# EAGLE design main (EAGLE 9.3.0)
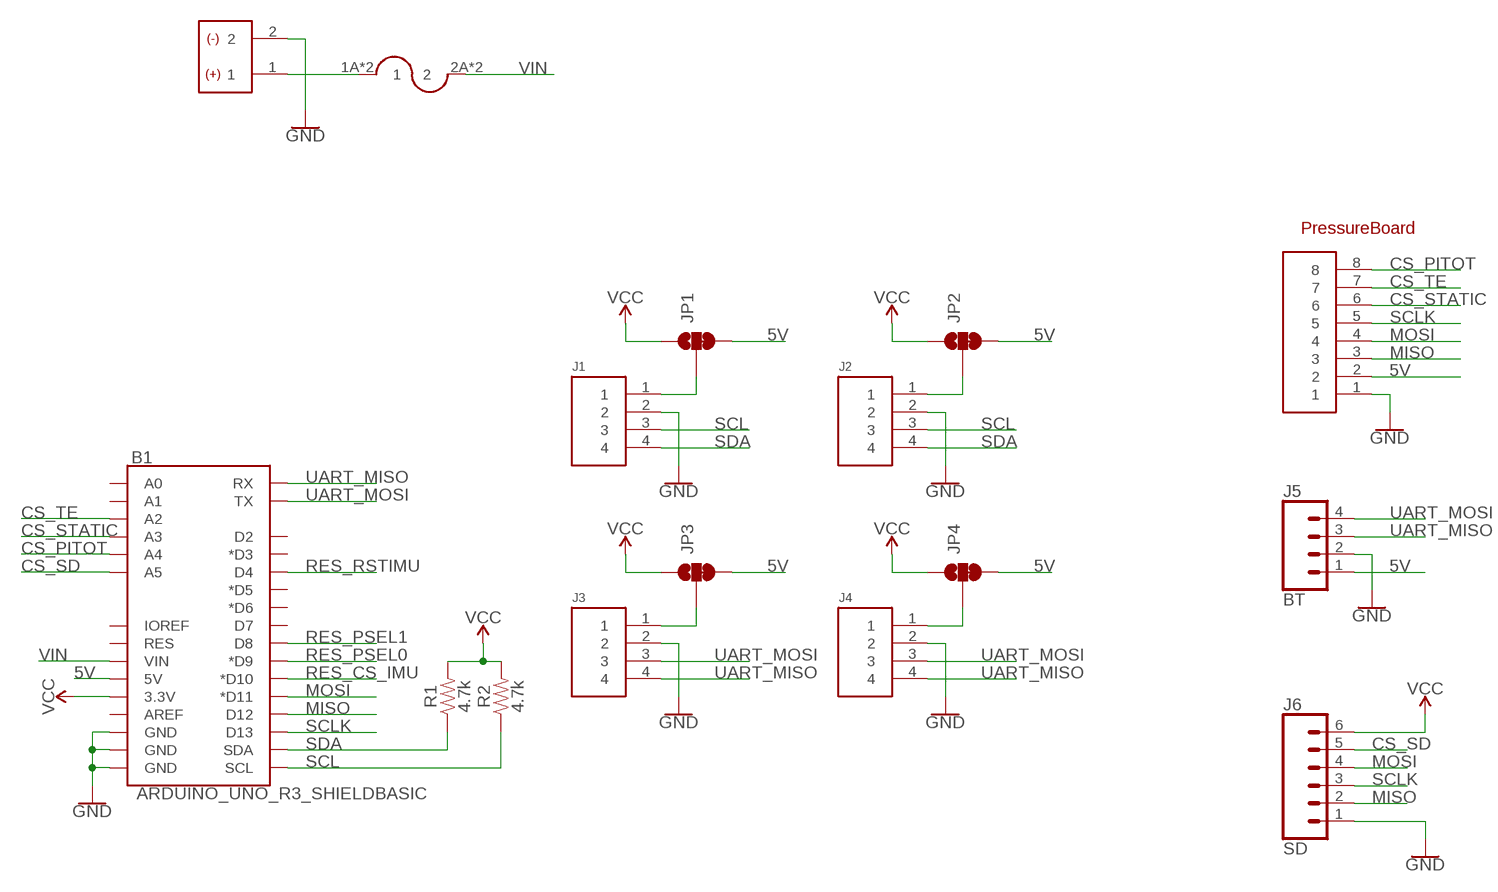
[diagram p0: schematic, sheet 1]

## Parts
B1  ARDUINO_UNO_R3_SHIELDBASIC  [UNO_R3_SHIELD]
J1  HEADER4VALULOK  [4PINVALULOK]
J2  HEADER4VALULOK  [4PINVALULOK]
J3  HEADER4VALULOK  [4PINVALULOK]
J4  HEADER4VALULOK  [4PINVALULOK]
J5  BT  CONN_041X04_NO_SILK  [1X04_NO_SILK]
J6  SD  CONN_06NO_SILK_NO_POP  [1X06_NO_SILK]
JP1  JUMPER-SMT_3_1-NC_TRACE_SILK  [SMT-JUMPER_3_1-NC_TRACE_SILK]
JP2  JUMPER-SMT_3_1-NC_TRACE_SILK  [SMT-JUMPER_3_1-NC_TRACE_SILK]
JP3  JUMPER-SMT_3_1-NC_TRACE_SILK  [SMT-JUMPER_3_1-NC_TRACE_SILK]
JP4  JUMPER-SMT_3_1-NC_TRACE_SILK  [SMT-JUMPER_3_1-NC_TRACE_SILK]
R1  4.7k  4.7KOHM-0603-1/10W-1%  [0603]
R2  4.7k  4.7KOHM-0603-1/10W-1%  [0603]
U$1  PB  HEADER8  [8PINVALULOK]
U$2  FUSE  [AUTO_FUSE]
U$3  HEADER2  [2PINVALULOK]

## Nets
5V: B1.5V J5.1 JP1.3 JP2.3 JP3.3 JP4.3 U$1.2
CS_PITOT: B1.A4 U$1.8
CS_SD: B1.A5 J6.5
CS_STATIC: B1.A3 U$1.6
CS_TE: B1.A2 U$1.7
GND: B1.GND@0(GND) B1.GND@1(GND) B1.GND@2(GND) J1.2 J2.2 J3.2 J4.2 J5.2 J6.1 U$1.1 U$3.2
MISO: B1.D12 J6.2 U$1.3
MOSI: B1.D11(*D11) J6.4 U$1.4
N$1: J2.1 JP2.2
N$2: J1.1 JP1.2
N$3: J3.1 JP3.2
N$4: J4.1 JP4.2
N$5: U$2.1A U$2.1B U$3.1
RES_CS_IMU: B1.D10(*D10)
RES_PSEL0: B1.D9(*D9)
RES_PSEL1: B1.D8
RES_RSTIMU: B1.D4
SCL: B1.SCL J1.3 J2.3 R2.1
SCLK: B1.D13 J6.3 U$1.5
SDA: B1.SDA J1.4 J2.4 R1.1
UART_MISO: B1.RX J3.4 J4.4 J5.3
UART_MOSI: B1.TX J3.3 J4.3 J5.4
VCC: B1.3.3V J6.6 JP1.1 JP2.1 JP3.1 JP4.1 R1.2 R2.2
VIN: B1.VIN U$2.2A U$2.2B
Unconnected: B1.A0 B1.A1 B1.AREF B1.D2 B1.D3(*D3) B1.D5(*D5) B1.D6(*D6) B1.D7 B1.IOREF B1.RES

## Notes on the sheet
- PressureBoard

## Library data of the parts
B1 = SparkFun-Boards:ARDUINO_UNO_R3_SHIELD: Arduino R3 Shield Footprint Shield form compatible with the Arduino Uno R3. SparkFun Products: MG2639 Cellular Shield <https://www.sparkfun.com/products/13120> MIDI Shield <https://www.sparkfun.com/products/12898> R3 Stackable Headers Kit <https://www.sparkfun.com/products/11417>
J1-J4 = Custom_old:HEADER4
J5 = SparkFun-Connectors:CONN_04: Multi connection point. Often used as Generic Header-pin footprint for 0.1 inch spaced/style header connections On any of the 0.1 inch spaced packages, you can populate with these: Break Away Headers - Straight <https://www.sparkfun.com/products/116> (PRT-00116) Break Away Male Headers - Right Angle <https://www.sparkfun.com/products/553> (PRT-00553) Female Headers <https://www.sparkfun.com/products/115> (PRT-00115) Break Away Headers - Machine Pin <https://www.sparkfun.com/products/117> (PRT-00117) Break Away Female Headers - Swiss Machine Pin <https://www.sparkfun.com/products/743> (PRT-00743) For SCREWTERMINALS and SPRING TERMINALS visit here: Screw Terimnals on SparkFun.com <https://www.sparkfun.com/search/results?term=Screw+Terminals> (5mm/3.5mm/2.54mm spacing) This device is also useful as a general connection point to wire up your design to another part of your project. Our various solder wires solder well into these plated through hole pads. Hook-Up Wire - Assortment (Stranded, 22 AWG) <https://www.sparkfun.com/products/11375> (PRT-11375) Hook-Up Wire - Assortment (Solid Core, 22 AWG) <https://www.sparkfun.com/products/11367> (PRT-11367) View the entire wire category on our website here <https://www.sparkfun.com/categories/141> Special notes: Molex polarized connector foot print use with SKU : PRT-08231 with associated crimp pins and housings. 1MM SMD Version SKU: PRT-10208; PROD_ID: CONN-09696
J6 = SparkFun-Connectors:CONN_06: Multi connection point. Often used as Generic Header-pin footprint for 0.1 inch spaced/style header connections On any of the 0.1 inch spaced packages, you can populate with these: Break Away Headers - Straight <https://www.sparkfun.com/products/116> (PRT-00116) Break Away Male Headers - Right Angle <https://www.sparkfun.com/products/553> (PRT-00553) Female Headers <https://www.sparkfun.com/products/115> (PRT-00115) Break Away Headers - Machine Pin <https://www.sparkfun.com/products/117> (PRT-00117) Break Away Female Headers - Swiss Machine Pin <https://www.sparkfun.com/products/743> (PRT-00743) Arduino Stackable Header - 6 Pin <https://www.sparkfun.com/products/9280> (PRT-09280) For SCREWTERMINALS and SPRING TERMINALS visit here: Screw Terimnals on SparkFun.com <https://www.sparkfun.com/search/results?term=Screw+Terminals> (5mm/3.5mm/2.54mm spacing) This device is also useful as a general connection point to wire up your design to another part of your project. Our various solder wires solder well into these plated through hole pads. Hook-Up Wire - Assortment (Stranded, 22 AWG) <https://www.sparkfun.com/products/11375> (PRT-11375) Hook-Up Wire - Assortment (Solid Core, 22 AWG) <https://www.sparkfun.com/products/11367> (PRT-11367) View the entire wire category on our website here <https://www.sparkfun.com/categories/141>
JP1-JP4 = SparkFun-Jumpers:JUMPER-SMT_3_1-NC_TRACE: Normally closed trace jumper (1 of 2 connections) This jumper has a trace between two pads so it's normally closed (NC). The other connection is normally open (NO). Use a razor knife to open the connection. For best results follow the IPC guidelines for cutting traces: Cutout at least 0.063 mm (0.005 in). Remove all loose material to clean up the cut area. Seal the cut with an approved epoxy. Reapply solder to reclose the connection, or to close the NO connection.
R1 R2 = SparkFun-Resistors:4.7KOHM: 4.7kΩ resistor A resistor is a passive two-terminal electrical component that implements electrical resistance as a circuit element. Resistors act to reduce current flow, and, at the same time, act to lower voltage levels within circuits. - Wikipedia; PROD_ID: RES-07857
U$1 = Custom_old:HEADER8
U$2 = Custom_old:FUSE
U$3 = Custom_old:HEADER2

## Board
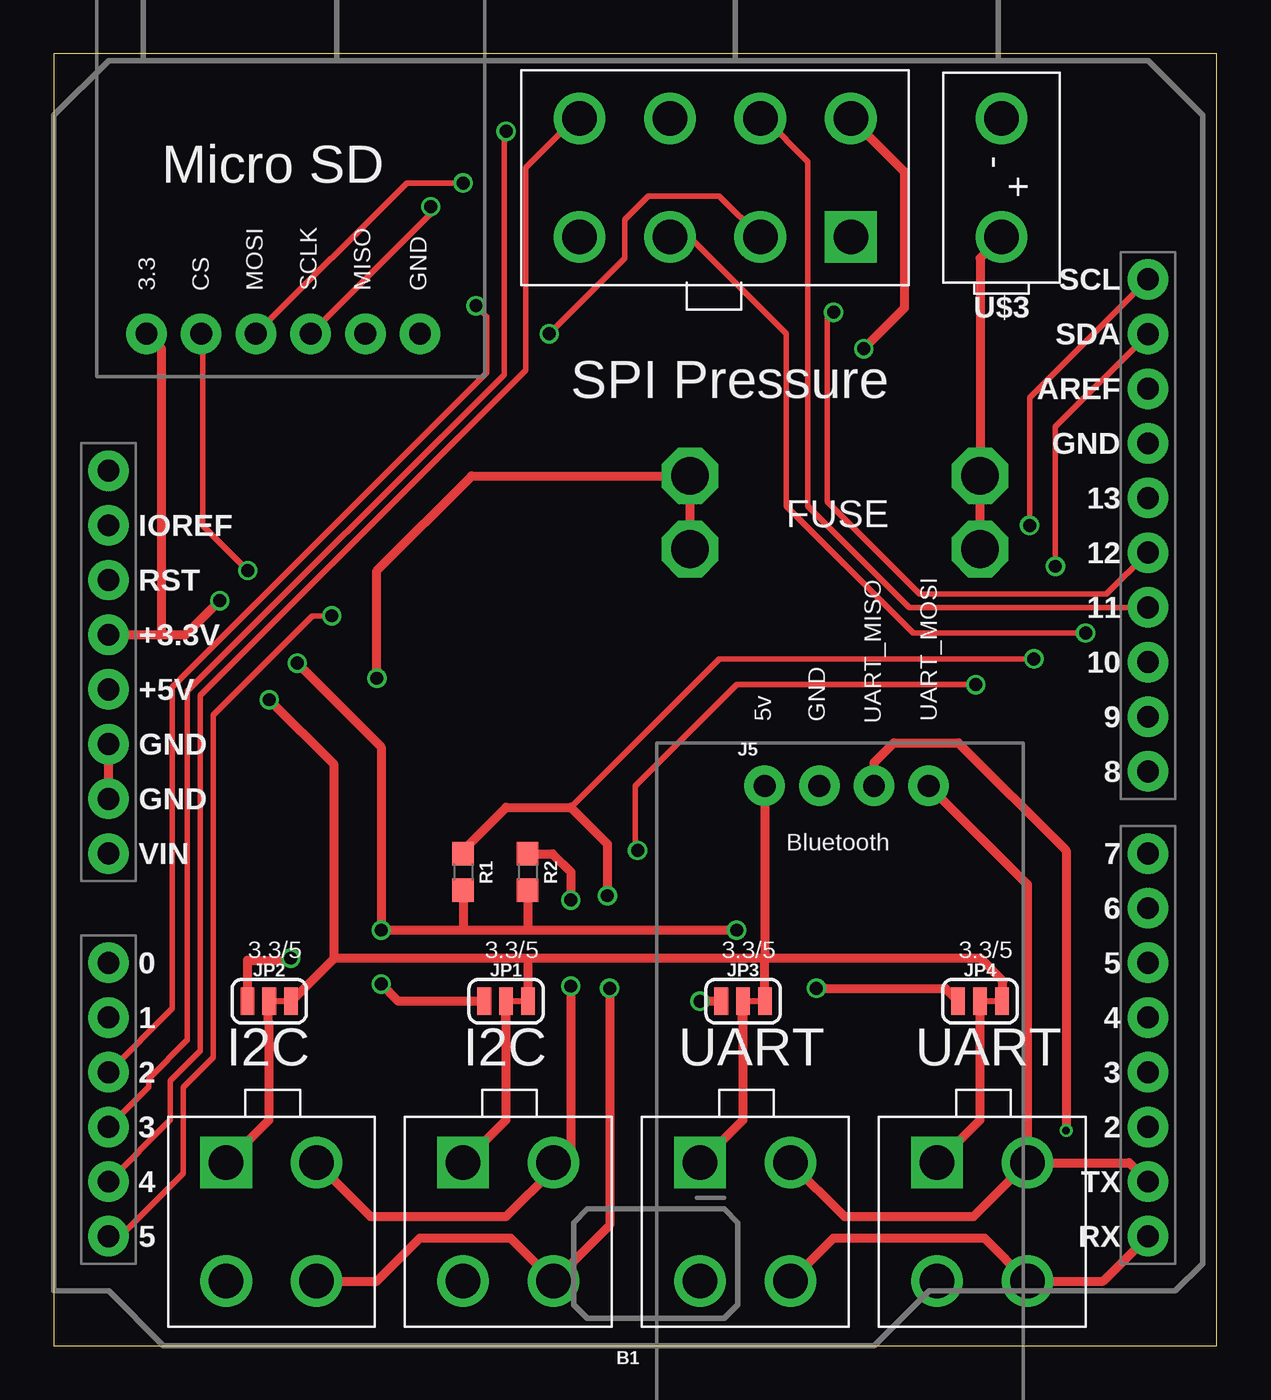
[diagram p1: board, top side]
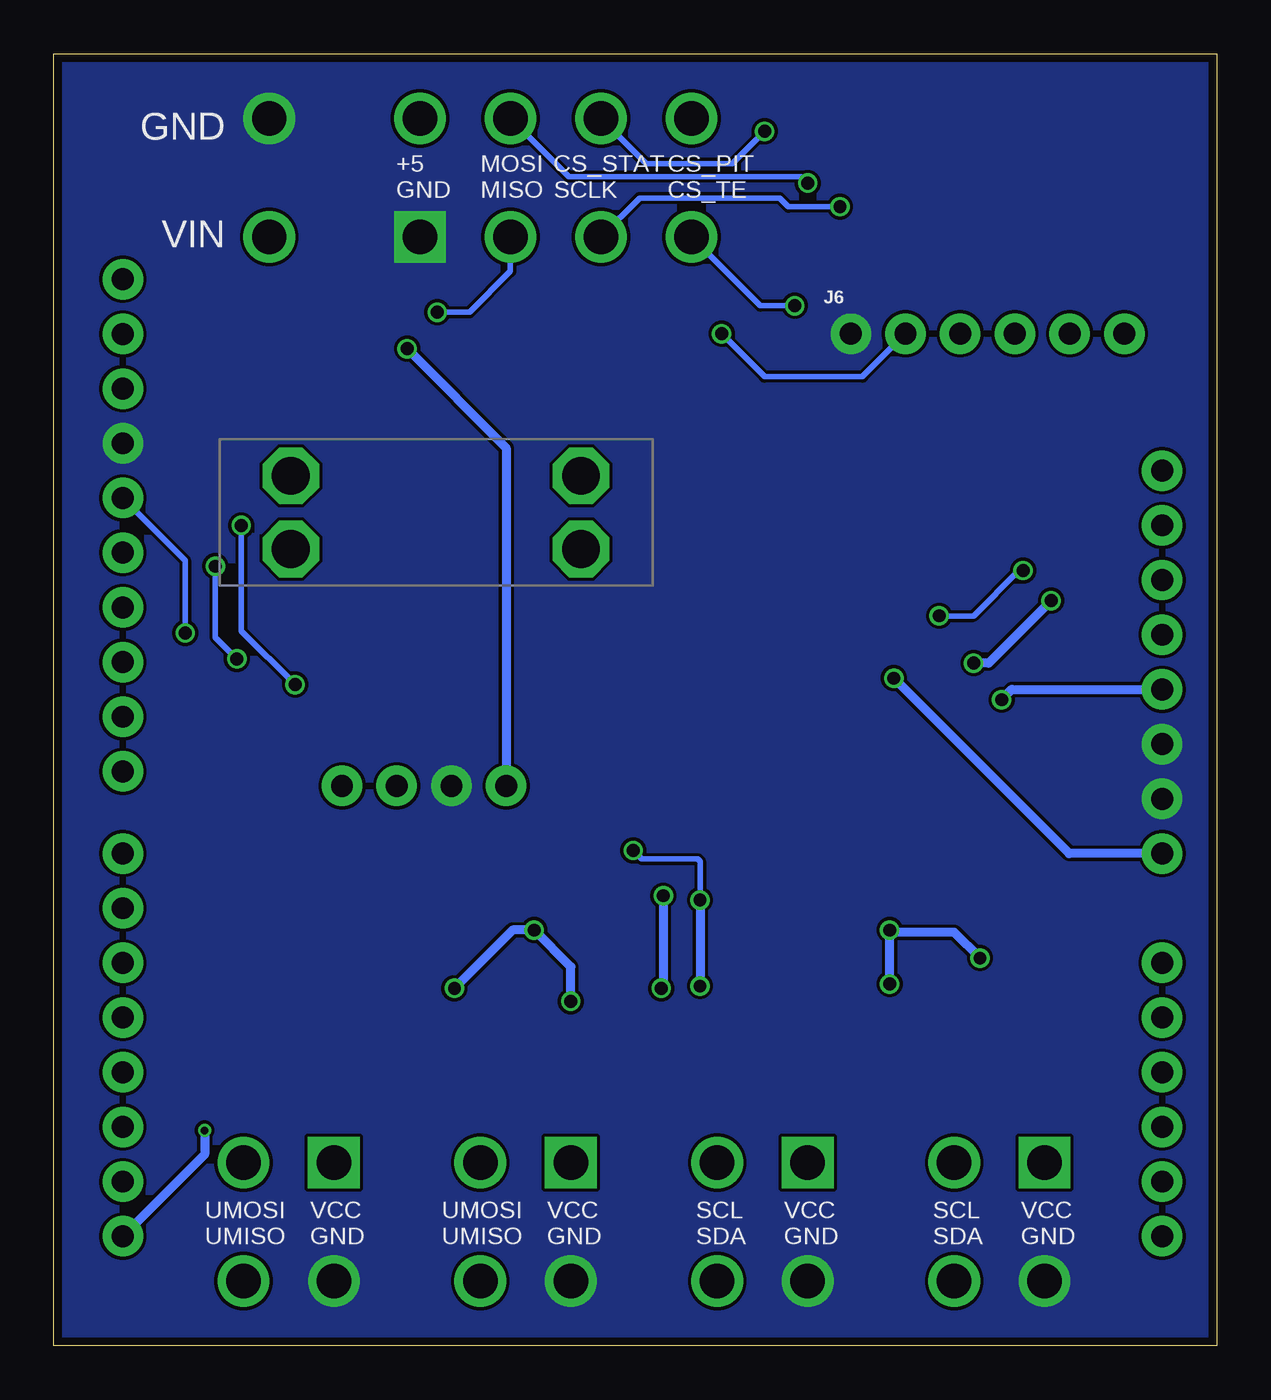
[diagram p2: board, bottom side, seen from below]

Size 54 x 60 mm. Coordinates in mm from the lower left corner, seen from the top.
Outline: 0,0 54,0 54,60 0,60 0,0
Copper layers (1*16): Top 0.035559375mm / dielectric 1.6mm / Bottom 0.035559375mm
Design rules "PATRICK-2lyr": minimum track width 6mil, minimum drill 10mil, track to track 6mil, track to pad 6mil, pad to pad 6mil, via to via 6mil, smd to smd 6mil, copper to edge 15mil, drill to drill 6mil, minimum pad ring 5mil, minimum via ring 5mil, stop-mask expansion 2.5mil, vias tented up to drill 25mil, thermal gap 10mil

### Footprints (pad centres in the part's own frame; a part is rotated, then mirrored left to right if it is on the bottom)
UNO_R3_SHIELD = drill 1.016 pad 1.88: 3.3V 24.13,-2.54; 5V 24.13,0; A0 24.13,12.7; A1 24.13,15.24; A2 24.13,17.78; A3 24.13,20.32; A4 24.13,22.86; A5 24.13,25.4; AREF -24.13,-13.97; D2 -24.13,20.32; D3 -24.13,17.78; D4 -24.13,15.24; D5 -24.13,12.7; D6 -24.13,10.16; D7 -24.13,7.62; D8 -24.13,3.81; D9 -24.13,1.27; D10 -24.13,-1.27; D11 -24.13,-3.81; D12 -24.13,-6.35; D13 -24.13,-8.89; GND@0 24.13,2.54; GND@1 24.13,5.08; GND@2 -24.13,-11.43; IOREF 24.13,-7.62; NC 24.13,-10.16; RES 24.13,-5.08; RX -24.13,25.4; SCL -24.13,-19.05; SDA -24.13,-16.51; TX -24.13,22.86; VIN 24.13,7.62
4PINVALULOK = drill 1.6 square: 1 0,5.5 | drill 1.6: 2 0,0; 3 4.2,5.5; 4 4.2,0
1X04_NO_SILK = drill 1.016 pad 1.88: 1 0,0; 2 2.54,0; 3 5.08,0; 4 7.62,0
1X06_NO_SILK = drill 1.016 pad 1.88: 1 0,0; 2 2.54,0; 3 5.08,0; 4 7.62,0; 5 10.16,0; 6 12.7,0
SMT-JUMPER_3_1-NC_TRACE_SILK = smd 0.635 x 1.27: 1 -1.016,0; 2 0,0; 3 1.016,0
0603 = smd 1.1 x 1: 1 -0.85,0; 2 0.85,0
8PINVALULOK = drill 1.6 square: 1 0,5.5 | drill 1.6: 2 0,0; 3 4.2,5.5; 4 4.2,0; 5 8.4,5.5; 6 8.4,0; 7 12.6,5.5; 8 12.6,0
AUTO_FUSE = drill 1.75 octagon: 1A 0,3.4; 1B 0,0; 2A 13.47,3.4; 2B 13.47,0
2PINVALULOK = drill 1.6: 1 0,5.5; 2 0,0

### Placement (x,y rotation side)
B1  26.67,30.48 180 top
J1  19,3 0 top
J2  8,3 0 top
J3  30,3 0 top
J4  41,3 0 top
J5  33,26 0 top
J6  17,47 0 bottom
JP1  21,16 0 top
JP2  10,16 0 top
JP3  32,16 0 top
JP4  43,16 0 top
R1  19,22 270 top
R2  22,22 270 top
U$1  37,57 180 top
U$2  43,37 0 bottom
U$3  44,57 180 top

### Tracks (layer width: path | path; a pad name or v marks a point on that pad's centre or on a via)
5V  (via drill 0.6)
  Top 0.254: JP4.3 44.07,16
  Top 0.406: JP2.3 13.01,17.99 | 13.01,17.99 13.02,18 22,18 | 44.07,16 44.07,16.93 43,18 33,18 | 22,18 33,18 | JP3.3 33.02,17.98 33,18 | JP1.3 22.02,17.98 22,18 | 13.01,17.99 13.01,26.99 v10,30 | J5.1 33,18 | v37.6,46.3 39.5,48.2 39.5,54.5 U$1.2
  Bottom 0.406: v10,30 9.52,30.48 B1.5V | J5.1 33,41.7 v37.6,46.3
CS_PITOT
  Top 0.254: B1.A4 5.4,10.48 5.4,12.3 6.8,13.7 6.8,30.2 21.9,45.3 21.9,54.7 24.2,57 U$1.8
CS_SD  (via drill 0.6)
  Top 0.254: B1.A5 3.08,5.08 6,8 6,12 7.4,13.4 7.4,29.3 12,33.9 v12.9,33.9 | v9,36 6.92,38.08 6.92,46.92
  Top 0.406: 6.92,46.92 J6.5
  Bottom 0.254: v12.9,33.9 11.3,33.9 9.2,36 v9,36
CS_STATIC  (via drill 0.6)
  Top 0.254: B1.A3 4.4,12.02 4.4,12.4 6.2,14.2 6.2,30.4 20.9,45.1 20.9,56.3 v21,56.4
  Bottom 0.254: v21,56.4 22.5,54.9 26.5,54.9 U$1.6
CS_TE  (via drill 0.6)
  Top 0.254: B1.A2 5.5,15.66 5.5,30.6 19.95,45.05 20.1,45.2 20.1,47.8 v19.6,48.3
  Bottom 0.254: v19.6,48.3 21.2,48.3 U$1.7
GND
  Top 0.406: B1.GND@1 B1.GND@0
  pour Bottom (no thermals): -1,61 55,61 55,-1 -1,-1
MISO  (via drill 0.6)
  Top 0.254: U$1.3 30.9,53.4 27.6,53.4 26.5,52.3 26.5,50.5 v23,47 | B1.D12 48.87,34.9 40.2,34.9 35.9,39.2 35.9,47.7 v36.2,48
  Bottom 0.254: J6.2 16.46,45 21,45 v23,47 | v36.2,48 34.7,48 32.8,49.9 U$1.3
MOSI  (via drill 0.6)
  Top 0.254: J6.4 16.38,54 v19,54 | B1.D11 39.71,34.29 35,39 35,55 33,57 U$1.4
  Bottom 0.254: v19,54 19.3,54.3 30.1,54.3 U$1.4
N$1
  Top 0.254: 9.95,16 JP2.2
  Top 0.406: J2.1 10,10.5 10,15 9.95,15.05 9.95,16
N$2
  Top 0.254: 20.95,16 JP1.2
  Top 0.406: J1.1 21,10.5 21,15 | 21,15 21,15.68 20.95,15.73 | 20.95,15.73 20.95,16 | 20.95,15.73 20.95,15.05 21,15
N$3
  Top 0.254: 31.95,16 JP3.2
  Top 0.406: J3.1 32,10.5 32,15 | 32,15 32,15.68 31.95,15.73 | 31.95,15.73 31.95,16 | 31.95,15.73 31.95,15.05 32,15
N$4
  Top 0.254: 42.95,16 JP4.2
  Top 0.406: J4.1 43,10.5 43,15.68 42.95,15.73 42.95,16
N$5
  Top 0.406: U$3.1 43,50.5 U$2.1A U$2.1B
SCL  (via drill 0.6)
  Top 0.254: B1.SCL 45.3,44.03 v45.3,38.1 | v42.8,30.7 31.7,30.7 27,26 27,23 v27.1,23
  Top 0.406: J2.3 14.7,6 21,6 23.2,8.2 | 23.2,8.2 J1.3 | R2.1 23.15,22.85 24,22 v24,20.7 | v24,16.7 24,9 23.2,8.2
  Bottom 0.254: v45.3,38.1 45.3,33.2 v42.8,30.7 | v27.1,23 26.7,22.6 24.1,22.6 24,22.5 v24,20.7
  Bottom 0.406: v24,20.7 v24,16.7
SCLK  (via drill 0.6)
  Top 0.254: J6.3 17.5,52.58 v17.5,52.9 | U$1.5 29.5,51.5 34,47 34,39 39.9,33.1 v47.9,33.1
  Bottom 0.254: v17.5,52.9 19.9,52.9 20.3,53.3 26.8,53.3 U$1.5 | B1.D13 47.9,36.47 v47.9,33.1
SDA  (via drill 0.6)
  Top 0.254: B1.SDA 46.5,42.69 v46.5,36.2 | v45.5,31.9 30.9,31.9 24,25
  Top 0.406: J2.4 15,3 17,5 21.2,5 J1.4 25.8,5.6 v25.8,16.6 | R1.1 19,23 21,25 24,25 25.7,23.3 v25.7,20.9
  Bottom 0.254: v46.5,36.2 46.5,32.9 v45.5,31.9
  Bottom 0.406: v25.7,20.9 25.7,16.7 v25.8,16.6
UART_MISO  (via drill 0.35)
  Top 0.406: J3.4 36.2,5 43.2,5 J4.4 48.72,3 B1.RX | J5.3 38.08,27.08 39,28 42,28 47,23 v47,10
  Bottom 0.406: v47,10 47,8.88 B1.RX
UART_MOSI
  Top 0.406: J3.3 36.7,6 42.7,6 J4.3 | J4.3 49.92,8.5 B1.TX | J5.4 45.2,21.42 J4.3
VCC  (via drill 0.6)
  Top 0.406: B1.3.3V 5,33.02 | J6.6 5,46.3 5,33.02 | JP2.1 9,16 9,17.9 11,17.9 v11,18 | 19,19.3 v15.2,19.3 15.2,27.8 v11.3,31.7 | 19,19.3 22,19.3 | 22,19.3 v31.7,19.3 | v35.4,16.6 41.38,16.6 JP4.1 | JP3.1 v30,16 | JP1.1 16,16 v15.2,16.8 | R1.2 19,19.3 | R2.2 22,19.3 | 5,33.02 6.12,33.02 v7.7,34.6
  Bottom 0.406: v11,18 12.2,19.2 15.2,19.2 v15.2,19.3 v15.2,16.8 | v35.4,16.6 32.7,19.3 v31.7,19.3 30,17.6 v30,16 | v7.7,34.6 10.6,31.7 v11.3,31.7
VIN  (via drill 0.6)
  Top 0.406: U$2.2B U$2.2A 19.4,40.4 15,36 v15,31
  Bottom 0.406: B1.VIN 6.86,22.86 v15,31

### Text on the board
tPlace: Micro SD | 3.3 | CS | MOSI | SCLK | MISO | GND | SPI Pressure | FUSE | 5v | GND | UART_MISO | UART_MOSI | Bluetooth | 3.3/5 | 3.3/5 | 3.3/5 | 3.3/5 | I2C | I2C | UART | UART
bPlace: GND | CS_PIT / CS_TE | CS_STAT / SCLK | MOSI / MISO | +5 / GND | VIN | VCC / GND | SCL / SDA | VCC / GND | SCL / SDA | VCC / GND | UMOSI / UMISO | VCC / GND | UMOSI / UMISO